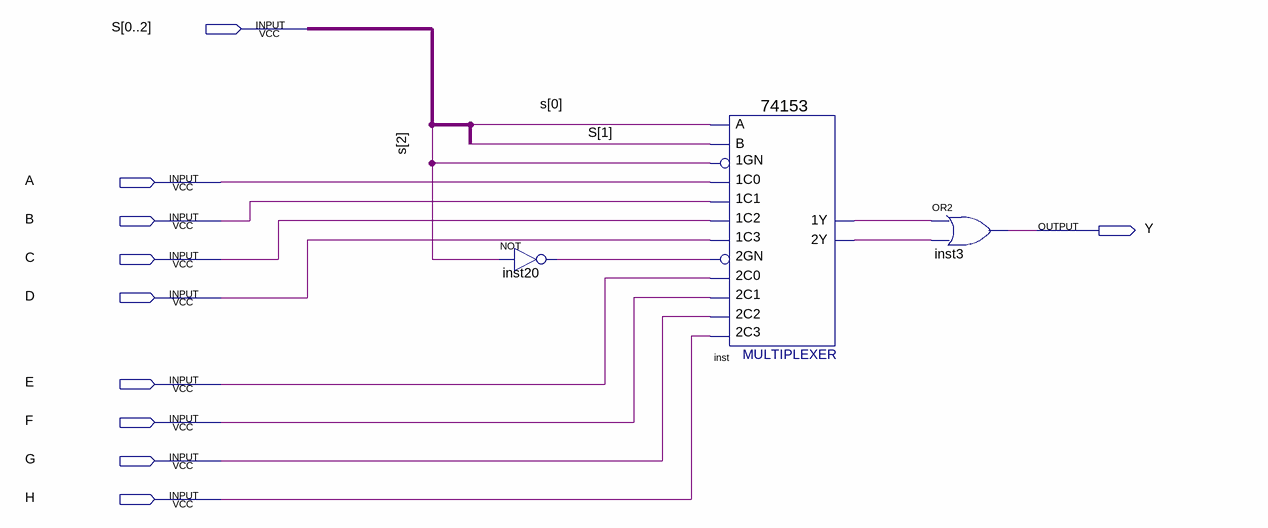
[diagram p0: schematic sheet]
// Quartus schematic Ex1.bdf as structural Verilog: 3 symbols, 10 pins
module Ex1 (
  input  [0:2] S,
  input  A,
  input  B,
  input  C,
  input  D,
  input  E,
  input  F,
  input  G,
  input  H,
  output Y
);

  wire inst20_out, inst_1y, inst_2y;

  not inst20 (inst20_out, S[2]);
  \74153  inst (
    .\1C1 (B), .\1GN (S[2]), .\1C0 (A), .\2C0 (E), .\2GN (inst20_out), .\2C2 (G), .\1C2 (C), .\1C3 (D),
    .B(S[1]), .A(S[0]), .\2C1 (F), .\2C3 (H), .\1Y (inst_1y), .\2Y (inst_2y));
  or inst3 (Y, inst_1y, inst_2y);
endmodule
